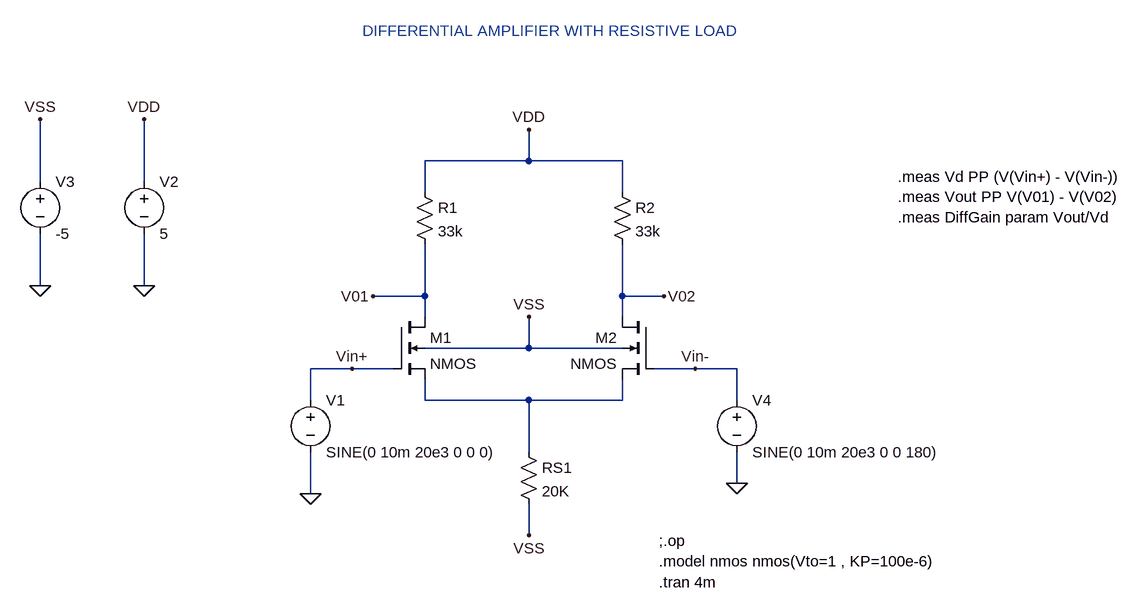
[diagram p0: schematic DIFFERENTIAL AMPLIFIER WITH RESISTIVE LOAD.asc]
DIFFERENTIAL AMPLIFIER WITH RESISTIVE LOAD.asc, the LTspice schematic file:
Version 4
SHEET 1 1264 700
WIRE 288 32 288 -16
WIRE 288 32 128 32
WIRE 432 32 288 32
WIRE -464 64 -464 -32
WIRE -304 64 -304 -32
WIRE 128 80 128 32
WIRE 432 80 432 32
WIRE -464 224 -464 144
WIRE -304 224 -304 144
WIRE 128 240 128 160
WIRE 128 240 48 240
WIRE 432 240 432 160
WIRE 496 240 432 240
WIRE 128 272 128 240
WIRE 432 272 432 240
WIRE 288 320 288 272
WIRE 288 320 128 320
WIRE 432 320 288 320
WIRE 16 352 -48 352
WIRE 80 352 16 352
WIRE 544 352 480 352
WIRE 608 352 544 352
WIRE -48 400 -48 352
WIRE 128 400 128 368
WIRE 288 400 128 400
WIRE 432 400 432 368
WIRE 432 400 288 400
WIRE 608 400 608 352
WIRE 288 480 288 400
WIRE 608 528 608 480
WIRE -48 544 -48 480
WIRE 288 608 288 560
FLAG 288 -16 VDD
FLAG -304 -32 VDD
FLAG 288 608 VSS
FLAG -464 -32 VSS
FLAG 288 272 VSS
FLAG 48 240 V01
FLAG 496 240 V02
FLAG -464 224 0
FLAG -304 224 0
FLAG -48 544 0
FLAG 608 528 0
FLAG 16 352 Vin+
FLAG 544 352 Vin-
SYMBOL res 112 64 R0
SYMATTR InstName R1
SYMATTR Value 33k
SYMBOL res 416 64 R0
SYMATTR InstName R2
SYMATTR Value 33k
SYMBOL res 272 464 R0
SYMATTR InstName RS1
SYMATTR Value 20K
SYMBOL nmos4 80 272 R0
SYMATTR InstName M1
SYMBOL nmos4 480 272 M0
SYMATTR InstName M2
SYMBOL voltage -48 384 R0
WINDOW 123 0 0 Left 0
WINDOW 39 0 0 Left 0
SYMATTR InstName V1
SYMATTR Value SINE(0 10m 20e3 0 0 0)
SYMBOL voltage -304 48 R0
WINDOW 123 0 0 Left 0
WINDOW 39 0 0 Left 0
SYMATTR InstName V2
SYMATTR Value 5
SYMBOL voltage -464 48 R0
WINDOW 123 0 0 Left 0
WINDOW 39 0 0 Left 0
SYMATTR InstName V3
SYMATTR Value -5
SYMBOL voltage 608 384 R0
WINDOW 123 0 0 Left 0
WINDOW 39 0 0 Left 0
SYMATTR InstName V4
SYMATTR Value SINE(0 10m 20e3 0 0 180)
TEXT 488 616 Left 2 !;.op
TEXT 488 648 Left 2 !.model nmos nmos(Vto=1 , KP=100e-6)
TEXT 488 680 Left 2 !.tran 4m
TEXT 32 -168 Left 2 ;DIFFERENTIAL AMPLIFIER WITH RESISTIVE LOAD
TEXT 856 56 Left 2 !.meas Vd PP (V(Vin+) - V(Vin-))\n.meas Vout PP V(V01) - V(V02)\n.meas DiffGain param Vout/Vd

The netlist it stands for:
* DIFFERENTIAL AMPLIFIER WITH RESISTIVE LOAD.asc
R1 VDD V01 33k
R2 VDD V02 33k
RS1 N001 VSS 20K
M1 V01 Vin+ N001 VSS NMOS
M2 V02 Vin- N001 VSS NMOS
V1 Vin+ 0 SINE(0 10m 20e3 0 0 0)
V2 VDD 0 5
V3 VSS 0 -5
V4 Vin- 0 SINE(0 10m 20e3 0 0 180)
.model NMOS NMOS
.model PMOS PMOS
.lib standard.mos
;.op
.model nmos nmos(Vto=1 , KP=100e-6)
.tran 4m
* DIFFERENTIAL AMPLIFIER WITH RESISTIVE LOAD
.meas Vd PP (V(Vin+) - V(Vin-))
.meas Vout PP V(V01) - V(V02)
.meas DiffGain param Vout/Vd
.backanno
.end